# EAGLE schematic RPI.v5_PCM5122brd (EAGLE 8.4.3)
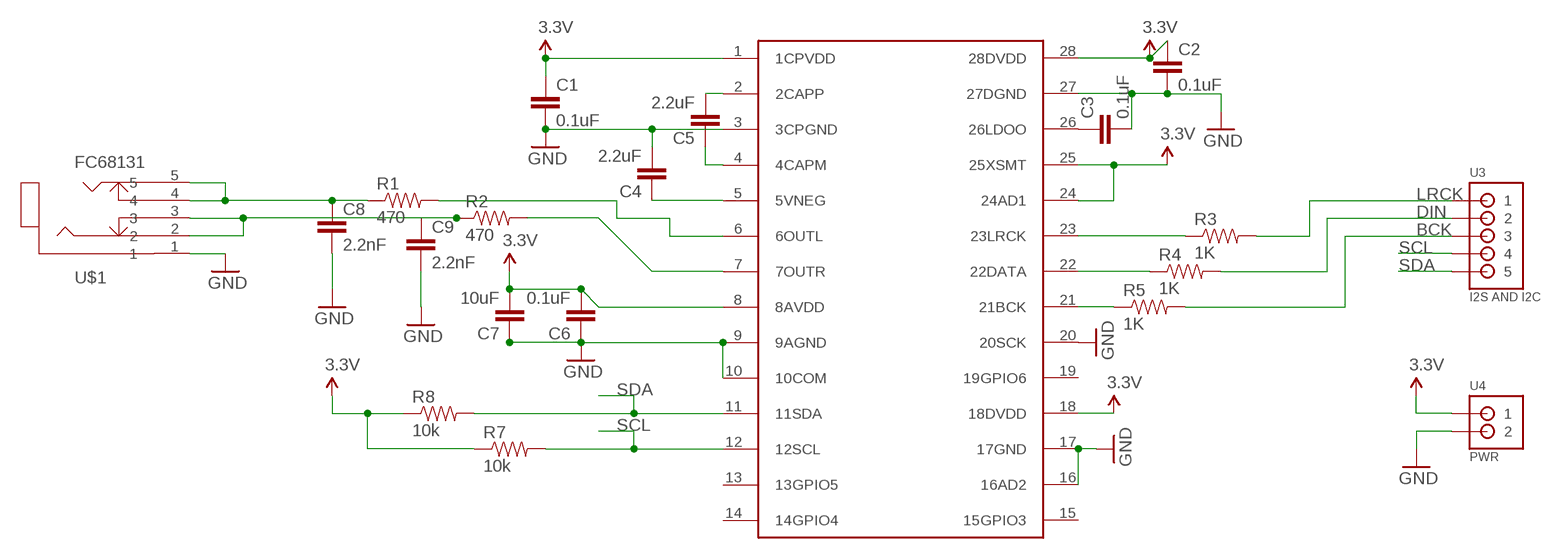
[diagram p0: schematic, sheet 1]

## Parts
C1  0.1uF  CAP0805  [0805]
C2  0.1uF  CAP0805  [0805]
C3  0.1uF  CAP0805  [0805]
C4  2.2uF  CAP0805  [0805]
C5  2.2uF  CAP0805  [0805]
C6  0.1uF  CAP0805  [0805]
C7  10uF  CAP0805  [0805]
C8  2.2nF  CAPPTH1  [CAP-PTH-5MM]
C9  2.2nF  CAPPTH1  [CAP-PTH-5MM]
R1  470  RESISTORPTH-1/4W  [AXIAL-0.4]
R2  470  RESISTORPTH-1/4W  [AXIAL-0.4]
R3  1K  RESISTOR0805-RES  [0805]
R4  1K  RESISTOR0805-RES  [0805]
R5  1K  RESISTOR0805-RES  [0805]
R7  10k  RESISTOR1206  [1206]
R8  10k  RESISTOR1206  [1206]
U3  I2S AND I2C  JST-PH_5-PIN_HEADER  [JST_B5B-PH_HEADER]
U4  PWR  JST-PH_2-PIN_HEADER  [JST_B2B-PH_HEADER]
U$1  FC68131  [FC68131-5P]
U$5  PCM5122  [TSSOP28]

## Nets
3.3V: C1.1 C2.1 C6.2 C7.2 R7.1 R8.1 U4.P1 U$5.1(1CPVDD) U$5.8(8AVDD) U$5.18(18DVDD) U$5.24(24AD1) U$5.25(25XSMT) U$5.28(28DVDD)
BCK: R5.2 U3.P3
DIN: R4.2 U3.P2
GND: C1.2 C2.2 C3.2 C4.2 C6.1 C7.1 C8.2 C9.2 U4.P2 U$1.1 U$5.3(3CPGND) U$5.9(9AGND) U$5.10(10COM) U$5.16(16AD2) U$5.17(17GND) U$5.20(20SCK) U$5.27(27DGND)
LRCK: R3.2 U3.P1
N$1: C3.1 U$5.26(26LDOO)
N$2: C5.2 U$5.2(2CAPP)
N$3: C5.1 U$5.4(4CAPM)
N$4: C4.1 U$5.5(5VNEG)
N$5: C9.1 R2.P$1 U$1.2 U$1.3
N$6: C8.1 R1.P$1 U$1.4 U$1.5
N$9: R3.1 U$5.23(23LRCK)
N$10: R4.1 U$5.22(22DATA)
N$11: R5.1 U$5.21(21BCK)
OUTL: R1.P$2 U$5.6(6OUTL)
OUTR: R2.P$2 U$5.7(7OUTR)
SCL: R7.2 U3.P4 U$5.12(12SCL)
SDA: R8.2 U3.P5 U$5.11(11SDA)
Unconnected: U$5.13(13GPIO5) U$5.14(14GPIO4) U$5.15(15GPIO3) U$5.19(19GPIO6)

## Library data of the parts
C1-C9 = SparkFun-Capacitors:CAP: Capacitor Standard 0603 ceramic capacitor, and 0.1" leaded capacitor.
R1-R5 R7 R8 = SparkFun-Resistors:RESISTOR: Resistor Basic schematic elements and footprints for 0603, 1206, and PTH resistors.
U3 = SRG:JST-PH_5-PIN_HEADER: 5-pin JST PH Shrouded Header, top entry P/N B5B-PH-K-S Mating connector PHR-5 Mating cable assembly: Sparkfun PRT-09917 <http://www.sparkfun.com/products/9917>
U4 = SRG:JST-PH_2-PIN_HEADER: 2-pin JST PH Shrouded Header, top entry P/N B2B-PH-K-S Mating connector PHR-2 Mating cable assembly: Sparkfun PRT-09914 <http://www.sparkfun.com/products/9914>
U$1 = con-cliff:FC68131
U$5 = ref-packages:PCM5122

## Net classes
0 default: width 0.356 mm